# Altium schematic sheet PUL_V5_RA.SchDoc
size Letter
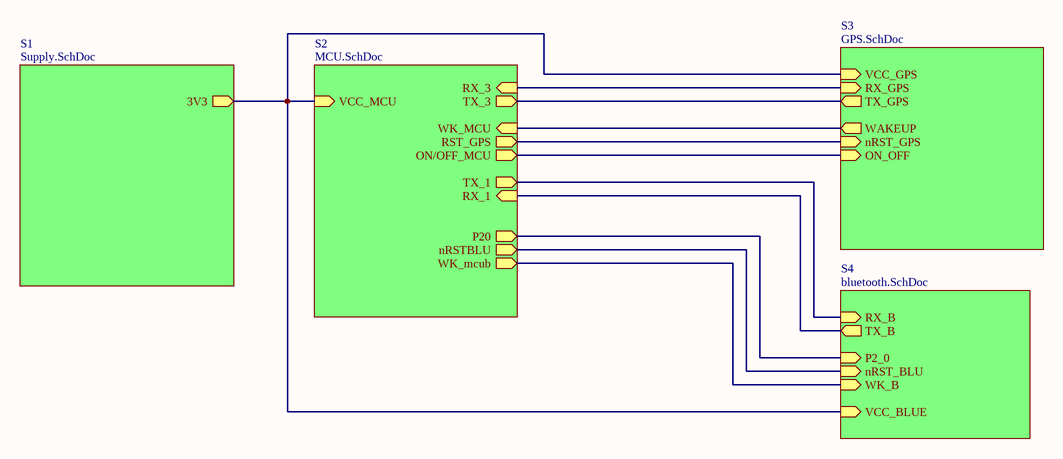
[diagram p0: PUL_V5_RA.SchDoc]

## Sub-sheets
S1 = Supply.SchDoc: 3V3 (out)
S2 = MCU.SchDoc: VCC_MCU (in), RX_3 (in), TX_3 (out), WK_MCU (in), RST_GPS (out), ON/OFF_MCU (out), RX_1 (in), TX_1 (out), P20 (out), nRSTBLU (out), WK_mcub (out)
S3 = GPS.SchDoc: VCC_GPS (in), ON_OFF (in), nRST_GPS (in), WAKEUP (out), RX_GPS (in), TX_GPS (out)
S4 = bluetooth.SchDoc: VCC_BLUE (in), RX_B (in), TX_B (out), P2_0 (in), nRST_BLU (in), WK_B (in)

## Nets
(unnamed): sheet S1/3V3, sheet S2/VCC_MCU, sheet S3/VCC_GPS, sheet S4/VCC_BLUE
(unnamed): sheet S2/RX_3, sheet S3/RX_GPS
(unnamed): sheet S2/TX_3, sheet S3/TX_GPS
(unnamed): sheet S2/WK_MCU, sheet S3/WAKEUP
(unnamed): sheet S2/RST_GPS, sheet S3/nRST_GPS
(unnamed): sheet S2/ON/OFF_MCU, sheet S3/ON_OFF
(unnamed): sheet S2/RX_1, sheet S4/TX_B
(unnamed): sheet S2/TX_1, sheet S4/RX_B
(unnamed): sheet S2/P20, sheet S4/P2_0
(unnamed): sheet S2/nRSTBLU, sheet S4/nRST_BLU
(unnamed): sheet S2/WK_mcub, sheet S4/WK_B

## Notes on the sheet
- Proyecto:
- CENTRO DE INGENIERIA Y DESARROLLO INDUSTRIAL
- Titulo:
- Fecha:
- Hoja:
- Elaborado por:
- de
- Hora:
- Revisión:
- Revisado por:
- CIDESI_template_letter